# Altium project UAV_STM_Sheild.PrjPcb
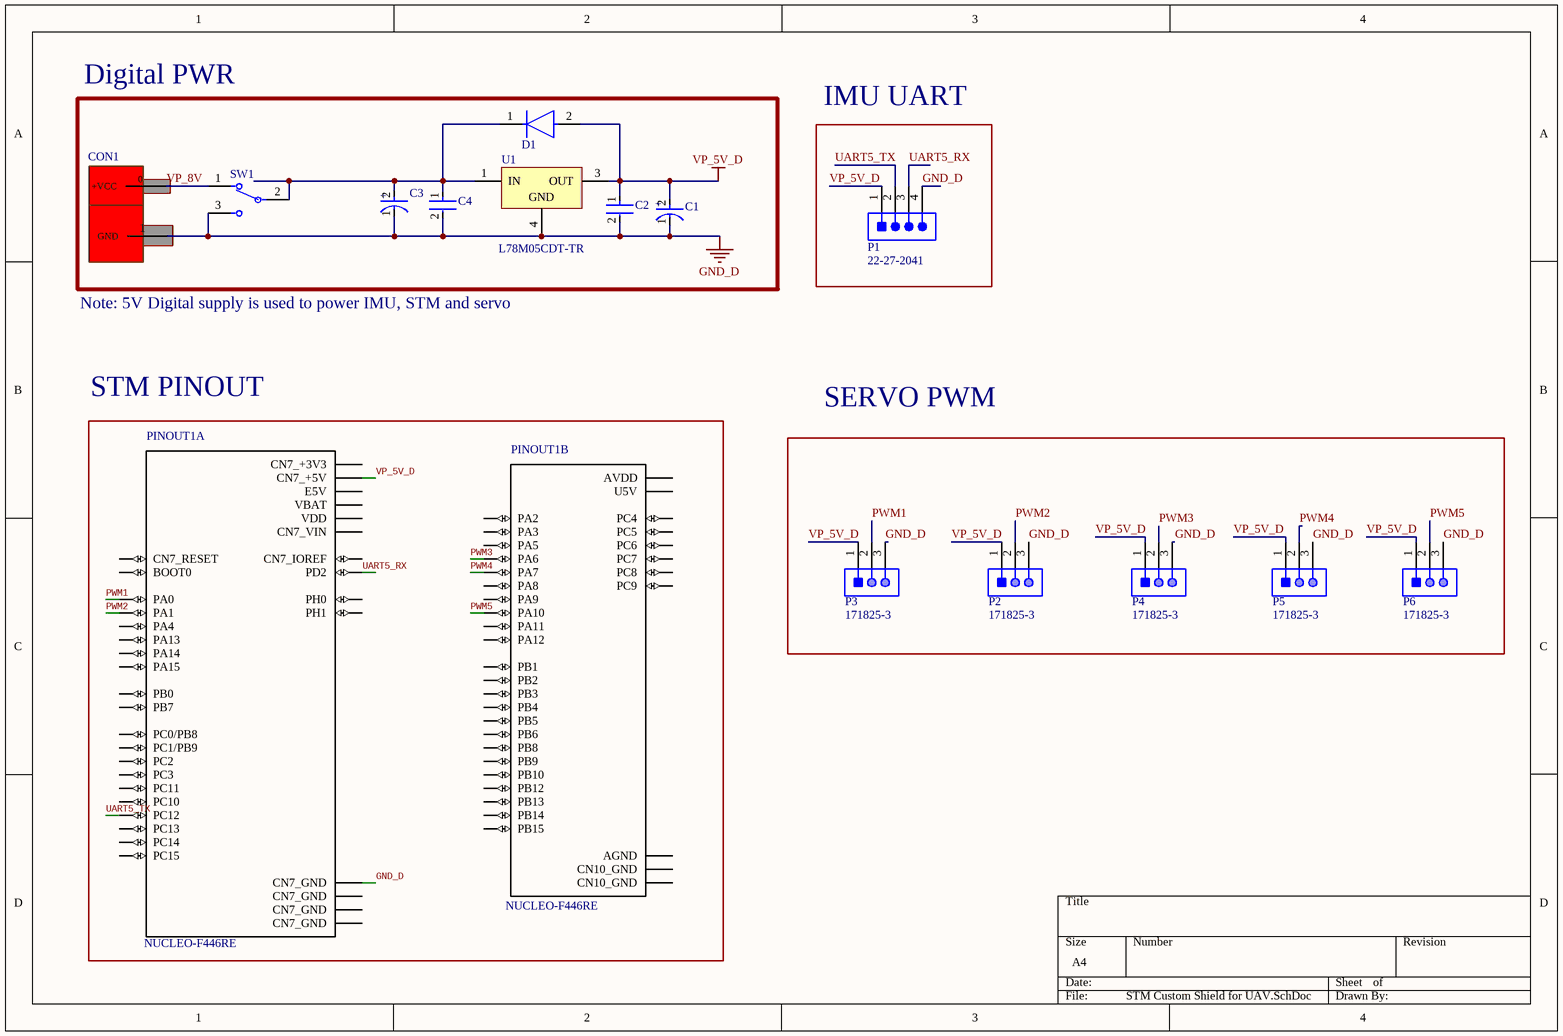
[diagram p0: STM Custom Shield for UAV.SchDoc]
1 sheet, 15 parts. Net scope: global (net labels, ports and power ports of the same name join across sheets).
Board file: STM Custom Shield for UAV.PcbDoc

## Sheet STM Custom Shield for UAV.SchDoc: STM Custom Shield for UAV
size A4; SheetNumber: 1; SheetTotal: 1

### Parts
C1  EEUFR1H101  [FP-RAD-TH-D_8_0_5-L_11_5-MFG]  (value not drawn)
C2  12061C104JAT2A  [FP-1206-L_3_2_0_2-W_1_6_0-IPC_C]  (value not drawn)
C3  EEUFR1H101  [FP-RAD-TH-D_8_0_5-L_11_5-MFG]  (value not drawn)
C4  12061C104JAT2A  [FP-1206-L_3_2_0_2-W_1_6_0-IPC_C]  (value not drawn)
CON1  T CONN  [Edge Connector]  (value not drawn)
D1  STTH1L06U  [FP-SMB-MFG]  (value not drawn)
P1  22-27-2041  [MOLX-22-27-2041_V]
P2  171825-3  [TECO-171825-3_V]
P3  171825-3  [TECO-171825-3_V]
P4  171825-3  [TECO-171825-3_V]
P5  171825-3  [TECO-171825-3_V]
P6  171825-3  [TECO-171825-3_V]
PINOUT1  NUCLEO-F446RE  [*MODULE_NUCLEO-F446RE_NUCLEO-F446RE(Primary)]  (parts A,B of 6)
SW1  A101SYCB04  [FP-A101SYCB04-MFG]  (value not drawn)
U1  L78M05CDT-TR  [TO-252_L]

### Blocks framed on the sheet
Digital PWR: C1-C4 CON1 D1 SW1 U1

### Nets
GND_D: C1.1(C) C2.2 C3.1(C) C4.2 CON1.1(GND) P1.4 P2.3 P3.3 P4.3 P5.3 P6.3 PINOUT1.CN7_8(CN7_GND) SW1.3 U1.4(GND)
VP_5V_D: C1.2(A) C2.1 D1.2(A) P1.1 P2.1 P3.1 P4.1 P5.1 P6.1 PINOUT1.CN7_18(CN7_+5V) U1.3(OUT)
PWM1: P3.2 PINOUT1.CN7_28(PA0)
PWM2: P2.2 PINOUT1.CN7_30(PA1)
PWM3: P4.2 PINOUT1.CN10_13(PA6)
PWM4: P5.2 PINOUT1.CN10_15(PA7)
PWM5: P6.2 PINOUT1.CN10_33(PA10)
UART5_RX: P1.3 PINOUT1.CN7_4(PD2)
UART5_TX: P1.2 PINOUT1.CN7_3(PC12)
VP_8V: CON1.0(+VCC) SW1.1
NetC3_2: C3.2(A) C4.1 D1.1(C) SW1.2 U1.1(IN)

Not connected (* = marked no-connect by the designer): PINOUT1 CN7_1(PC10) CN7_2(PC11) CN7_5(VDD) CN7_6(E5V) CN7_7(BOOT0) CN7_12(CN7_IOREF) CN7_13(PA13) CN7_14(CN7_RESET) CN7_15(PA14) CN7_16(CN7_+3V3) CN7_17(PA15) CN7_19(CN7_GND) CN7_20(CN7_GND) CN7_21(PB7) CN7_22(CN7_GND) CN7_23(PC13) CN7_24(CN7_VIN) CN7_25(PC14) CN7_27(PC15) CN7_29(PH0) CN7_31(PH1) CN7_32(PA4) CN7_33(VBAT) CN7_34(PB0) CN7_35(PC2) CN7_36(PC1/PB9) CN7_37(PC3) CN7_38(PC0/PB8) CN10_1(PC9) CN10_2(PC8) CN10_3(PB8) CN10_4(PC6) CN10_5(PB9) CN10_6(PC5) CN10_7(AVDD) CN10_8(U5V) CN10_9(CN10_GND) CN10_11(PA5) CN10_12(PA12) CN10_14(PA11) CN10_16(PB12) CN10_17(PB6) CN10_19(PC7) CN10_20(CN10_GND) CN10_21(PA9) CN10_22(PB2) CN10_23(PA8) CN10_24(PB1) CN10_25(PB10) CN10_26(PB15) CN10_27(PB4) CN10_28(PB14) CN10_29(PB5) CN10_30(PB13) CN10_31(PB3) CN10_32(AGND) CN10_34(PC4) CN10_35(PA2) CN10_37(PA3)

### Notes on the sheet
- IMU UART
- Note: 5V Digital supply is used to power IMU, STM and servo
- STM PINOUT
- SERVO PWM
- (in symbol CMP-05427-002079-1) +

### Library data of the parts
C1 C3 = CMP-05427-002079-1: Aluminum Electrolytic Capacitors (Radial Lead Type) 100uF ±20% 50V; ESR (Equivalent Series Resistance): 61mR; Lead Diameter: 0.6mm; Ripple Current (AC): 870mA; Life (Hours): 6000Hour; Lead/Base Style: Straight; Height - Seated (Max): 0.512inch; Height: 11.5mm; REACH SVHC: No SVHC; Contact Plating: Tin; Impedance: 61mR; Capacitance: 100uF; Voltage: 50V; Termination: Radial; Series: FR; Voltage Rating: 50V; Lead Pitch: 3.5mm; Diameter: 8mm; Number of Pins: 2; Min Operating Temperature: -40°C; Mount: Through Hole; Ripple Current: 870mA; Radiation Hardening: No; Length: 11.5mm; Max Operating Temperature: 105°C; Construction: RADIAL; Packaging: Bulk; Package Quantity: 200; Case/Package: Radial; RoHS Compliant: Yes; Voltage Rating (DC): 50V; Tolerance: 20%
C2 C4 = CMP-04427-013576-1: General Purpose Ceramic Capacitor, 1206, 100nF, 5%, X7R, 15%, 100V; Max Operating Temperature: 125°C; Depth: 1.6mm; Package Quantity: 1; Thickness: 0.05inch; Number of Pins: 2; Height: 1.27mm; Voltage Rating (DC): 100V; Radiation Hardening: No; Termination: SMD/SMT; Construction: Flat; REACH SVHC: No SVHC; Case/Package: 1206; Case Code (Imperial): 1206; Tolerance: 5%; Width: 0.063inch; Voltage: 100V; Packaging: Tape and Reel; Voltage Rating: 100V; Case Code (Metric): 3216; Capacitance: 100nF; Min Operating Temperature: -55°C; Length: 3.2mm; Dielectric: X7R; Mount: Surface Mount; Dielectric Material: Ceramic; Contact Plating: Tin; RoHS Compliant: Yes; Lead Free: Lead Free; Series: -
D1 = CMP-12188-000011-1: DIODE GEN PURP 600V 1A SMB; Manufacturer: STMicroelectronics; Peak Reverse Current: 1uA; Max Junction Temp: +175°C; Max Surge Forward Current: 20A; Standoff Height: 0.05mm; Temperature Range High: +175°C; Manufacturer Part Number: STTH1L06U; Device Class L1: Discrete Semiconductors; Lead Free: Yes; Max Repetitive Reverse Voltage: 600V; Mouser Description: STTH1L06 Series 1 A 1.05 V 80 ns Turbo 2 Ultrafast Rectifier SMT - DO-214AA; Temperature: to +175°C; ComponentLink2URL: https://www.st.com/resource/en/datasheet/stth1l06.pdf; Reverse Voltage: 600V; Device Class L3: Rectifier Diodes; Device Class L2: Diodes; Automotive: No; Category: Diode; RoHS: TRUE; Height: 2.65mm; ComponentLink2Description: Datasheet; Octopart: https://octopart.com/stth1l06u-stmicroelectronics-324444; Digikey Description: DIODE GEN PURP 600V 1A SMB; Package: SMB; Forward Current: 1A
P1 = CMP-2000-05243-1: Male Header, Pitch 2.54 mm, 1 x 4 Position, Height 11.7 mm, Tail Length 3.56 mm, RoHS, Bulk; Manufacturer: Molex; Voltage rating: 250V; Current rating: 4A; Datasheet Version: Rev. F, 06/2009; Operating temperature: 0degCto+75degC; Contact material: Tinplatedbrass; Manufacturer URL: http://www.molex.com/; Housing material: Nylon(UL94V-0); Datasheet URL: http://www.molex.com/pdm_docs/sd/022272041_sd.pdf
P2-P6 = CMP-2000-07494-1: Male Header, Pitch 2.5 mm, 1 x 3 Position, Height 10.4 mm, Tail Length 3.6 mm, / -20 to 95 degC / , RoHS, Bulk; Manufacturer: TE Connectivity; Mating Alignment: Yes(With); Tail Length: 0.142inch; Mating Post Length: 7.5mm; PCB Thickness: 0.063inch; PCB Mount Alignment: No(Without); Voltage Rating: 350V; Max Voltage Rating (AC): 250V; Plating Thickness: 0.8um; PCB Mounting Orientation: Vertical; Number of Positions: 3; PCB Mount Retention: Without; Max Current Rating: 3.5A; Max Voltage Rating (DC): 350.25kV; Pitch: 2.5mm; Approvals: UL; Contact Resistance: 20mOhm; Mount: ThroughHole; Length: 7.5mm; Orientation: Straight; Contact Mating Length: 0.295inch; Contact Material: Brass; Housing Material: Nylon; Package Description: Male Header, Pitch 2.5 mm, 1 x 3 Position, Height 10.4 mm, Tail Length 3.6 mm; Colour: Natural; Backwall/Post Interruptions: No(Without); Min Operating Temperature: -20degC; Mating Retention: Yes(With); Connector Type: Header; Packaging: Bag; RoHSCompliant: True; Package Reference: 171825-3; Contact Shape: Square; Strain Relief: No(Without); Contact Gender: Male; Number of Contacts: 3; Manufacturer URL: http://www.te.com/; Height: 0.409inch; Contact Retention: No(Without); Datasheet Version: Rev. Y3, 12/2016; Panel Mount Retention: No(Without); Datasheet URL: http://www.te.com/commerce/DocumentDelivery/DDEController?Action=showdoc&DocId=Customer+Drawing%7F171825%7FY3%7Fpdf%7FEnglish%7FENG_CD_171825_Y3.pdf%7F171825-3; Termination: Solder; Mounting Technology: ThroughHole; Max Operating Temperature: 95degC; Flammability Rating: UL94V-0; REACH SVHC: NoSVHC; Housing Colour: Natural; Package Quantity: 1000; Number of Rows: 1; Depth: 4.9mm; Contact Plating: Tin
SW1 = CMP-03408-000017-1: SWITCH TOGGLE SPDT 0.4VA 20V; Electrical Life: 6000Cycles; Number of Poles: 1; Power Rating: 400mW; Switch Function: On-On; Contact Resistance: 10mR; Contact Current Rating: 400mA; Actuator Material: Phenolic; Insulation Resistance: 30MR; Actuator Color: Chrome; Number of Positions: 2; Actuator Type: Standard Round; Actuator Length: 10.41mm; Illumination Type: Non-Illuminated; Flammability Rating: UL94 V-1; Contact Material: Copper; Depth: 6.86mm; Contact Plating: Gold; Voltage Rating (AC): 20V; Max Voltage Rating (DC): 20V; Min Operating Temperature: -30°C; Max Operating Temperature: 85°C; Throw Configuration: SPDT; Packaging: Bulk; Termination: PC Pins; Series: Gemini A; ELV: Compliant; Lead Free: Lead Free; RoHS Compliant: Yes; REACH SVHC: No SVHC; Mount: Panel; Orientation: Straight; Package Quantity: 100; Max Voltage Rating (AC): 20V; Radiation Hardening: No; Voltage Rating (DC): 20V
U1 = CMP-0244-00178-1: Positive Voltage Regulator, 5V, 3-Pin DPAK, Tape and Reel; PackageReference: TO-252; ComponentLink1URL: http://www.st.com; ComponentLink2Description: Datasheet; PackageDescription: 3-Pin Transistor Outline Package 2.28 mm Pitch, 9.7 mm Lead Span (DPAK); ComponentLink1Description: Manufacturer URL; DatasheetVersion: 1/11/2010; ComponentLink2URL: http://www.st.com/internet/com/TECHNICAL_RESOURCES/TECHNICAL_LITERATURE/DATASHEET/CD00000447.pdf; PackageVersion: 2011
PINOUT1 = NUCLEO-F446RE: Check_prices: https://www.snapeda.com/parts/NUCLEO-F446RE/STMicroelectronics/view-part/?ref=eda; SnapEDA_Link: https://www.snapeda.com/parts/NUCLEO-F446RE/STMicroelectronics/view-part/?ref=snap; Value: *